# Altium project NAPaC_DevKitC-DetachableModule.PrjPCB
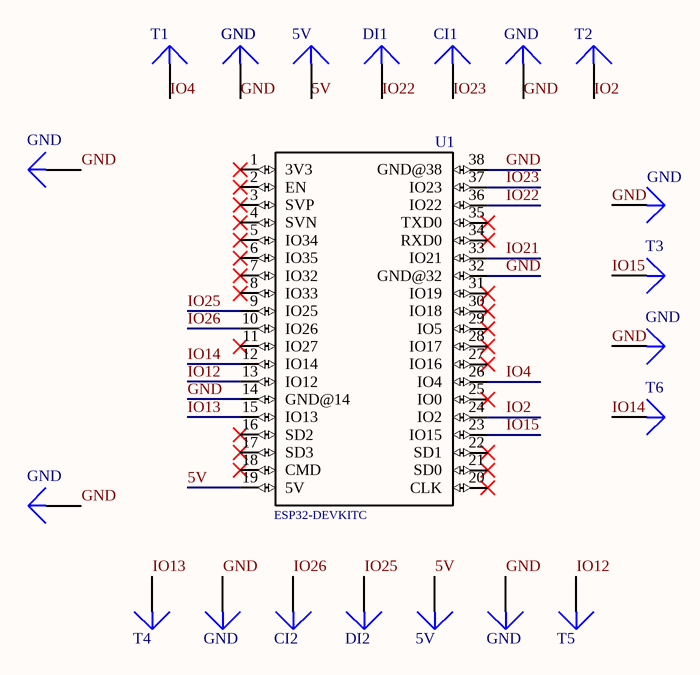
[diagram p0: NAPaC_DevKitC-DetachableModule.SchDoc]
1 sheet, 22 parts. Net scope: global (net labels, ports and power ports of the same name join across sheets).
Board file: NAPaC_DevKitC-DetachableModule.PcbDoc

## Sheet NAPaC_DevKitC-DetachableModule.SchDoc
size A4

### Parts
(Parts that share a designator on the sheet are numbered #1, #2 ... from top to bottom, then left to right.)
5V#1  Plug  [PLUG]  (value not drawn)
5V#2  Plug  [PLUG]  (value not drawn)
CI1  Plug  [PLUG]  (value not drawn)
CI2  Plug  [PLUG]  (value not drawn)
DI1  Plug  [PLUG]  (value not drawn)
DI2  Plug  [PLUG]  (value not drawn)
GND#1  Plug  [PLUG]  (value not drawn)
GND#2  Plug  [PLUG]  (value not drawn)
GND#3  Plug  [PLUG]  (value not drawn)
GND#4  Plug  [PLUG]  (value not drawn)
GND#5  Plug  [PLUG]  (value not drawn)
GND#6  Plug  [PLUG]  (value not drawn)
GND#7  Plug  [PLUG]  (value not drawn)
GND#8  Plug  [PLUG]  (value not drawn)
GND#9  Plug  [PLUG]  (value not drawn)
T1  Plug  [PLUG]  (value not drawn)
T2  Plug  [PLUG]  (value not drawn)
T3  Plug  [PLUG]  (value not drawn)
T4  Plug  [PLUG]  (value not drawn)
T5  Plug  [PLUG]  (value not drawn)
T6  Plug  [PLUG]  (value not drawn)
U1  ESP32DEVKITC  [ESP32DEVKITC]  (value not drawn)

### Nets
5V: 5V#1.1 5V#2.1 U1.19(5V)
GND: GND#1.1 GND#2.1 GND#3.1 GND#4.1 GND#5.1 GND#6.1 GND#7.1 GND#8.1 GND#9.1 U1.14(GND@14) U1.32(GND@32) U1.38(GND@38)
IO2: T2.1 U1.24(IO2)
IO4: T1.1 U1.26(IO4)
IO12: T5.1 U1.13(IO12)
IO13: T4.1 U1.15(IO13)
IO14: T6.1 U1.12(IO14)
IO15: T3.1 U1.23(IO15)
IO21: U1.33(IO21)
IO22: DI1.1 U1.36(IO22)
IO23: CI1.1 U1.37(IO23)
IO25: DI2.1 U1.9(IO25)
IO26: CI2.1 U1.10(IO26)

Not connected (* = marked no-connect by the designer): U1 1(3V3)* 2(EN)* 3(SVP)* 4(SVN)* 5(IO34)* 6(IO35)* 7(IO32)* 8(IO33)* 11(IO27)* 16(SD2)* 17(SD3)* 18(CMD)* 20(CLK)* 21(SD0)* 22(SD1)* 25(IO0)* 27(IO16)* 28(IO17)* 29(IO5)* 30(IO18)* 31(IO19)* 34(RXD0)* 35(TXD0)*

### Library data of the parts
U1 = ESP32DEVKITC: Dev Board Kit; MF: Espressif Systems; MP: ESP32-DEVKITC; Price: 16.97 USD; Availability: Unavailable; Package: None; SnapEDA_Link: https://www.snapeda.com/parts/ESP32-DEVKITC/Espressif%20Systems/view-part/?ref=snap; Value: *
5V#1 5V#2 CI1 CI2 DI1 DI2 GND#1-GND#9 T1-T6 = Plug: LatestRevisionDate: 17-Jul-2002; LatestRevisionNote: Re-released for DXP Platform.; Publisher: Altium Limited